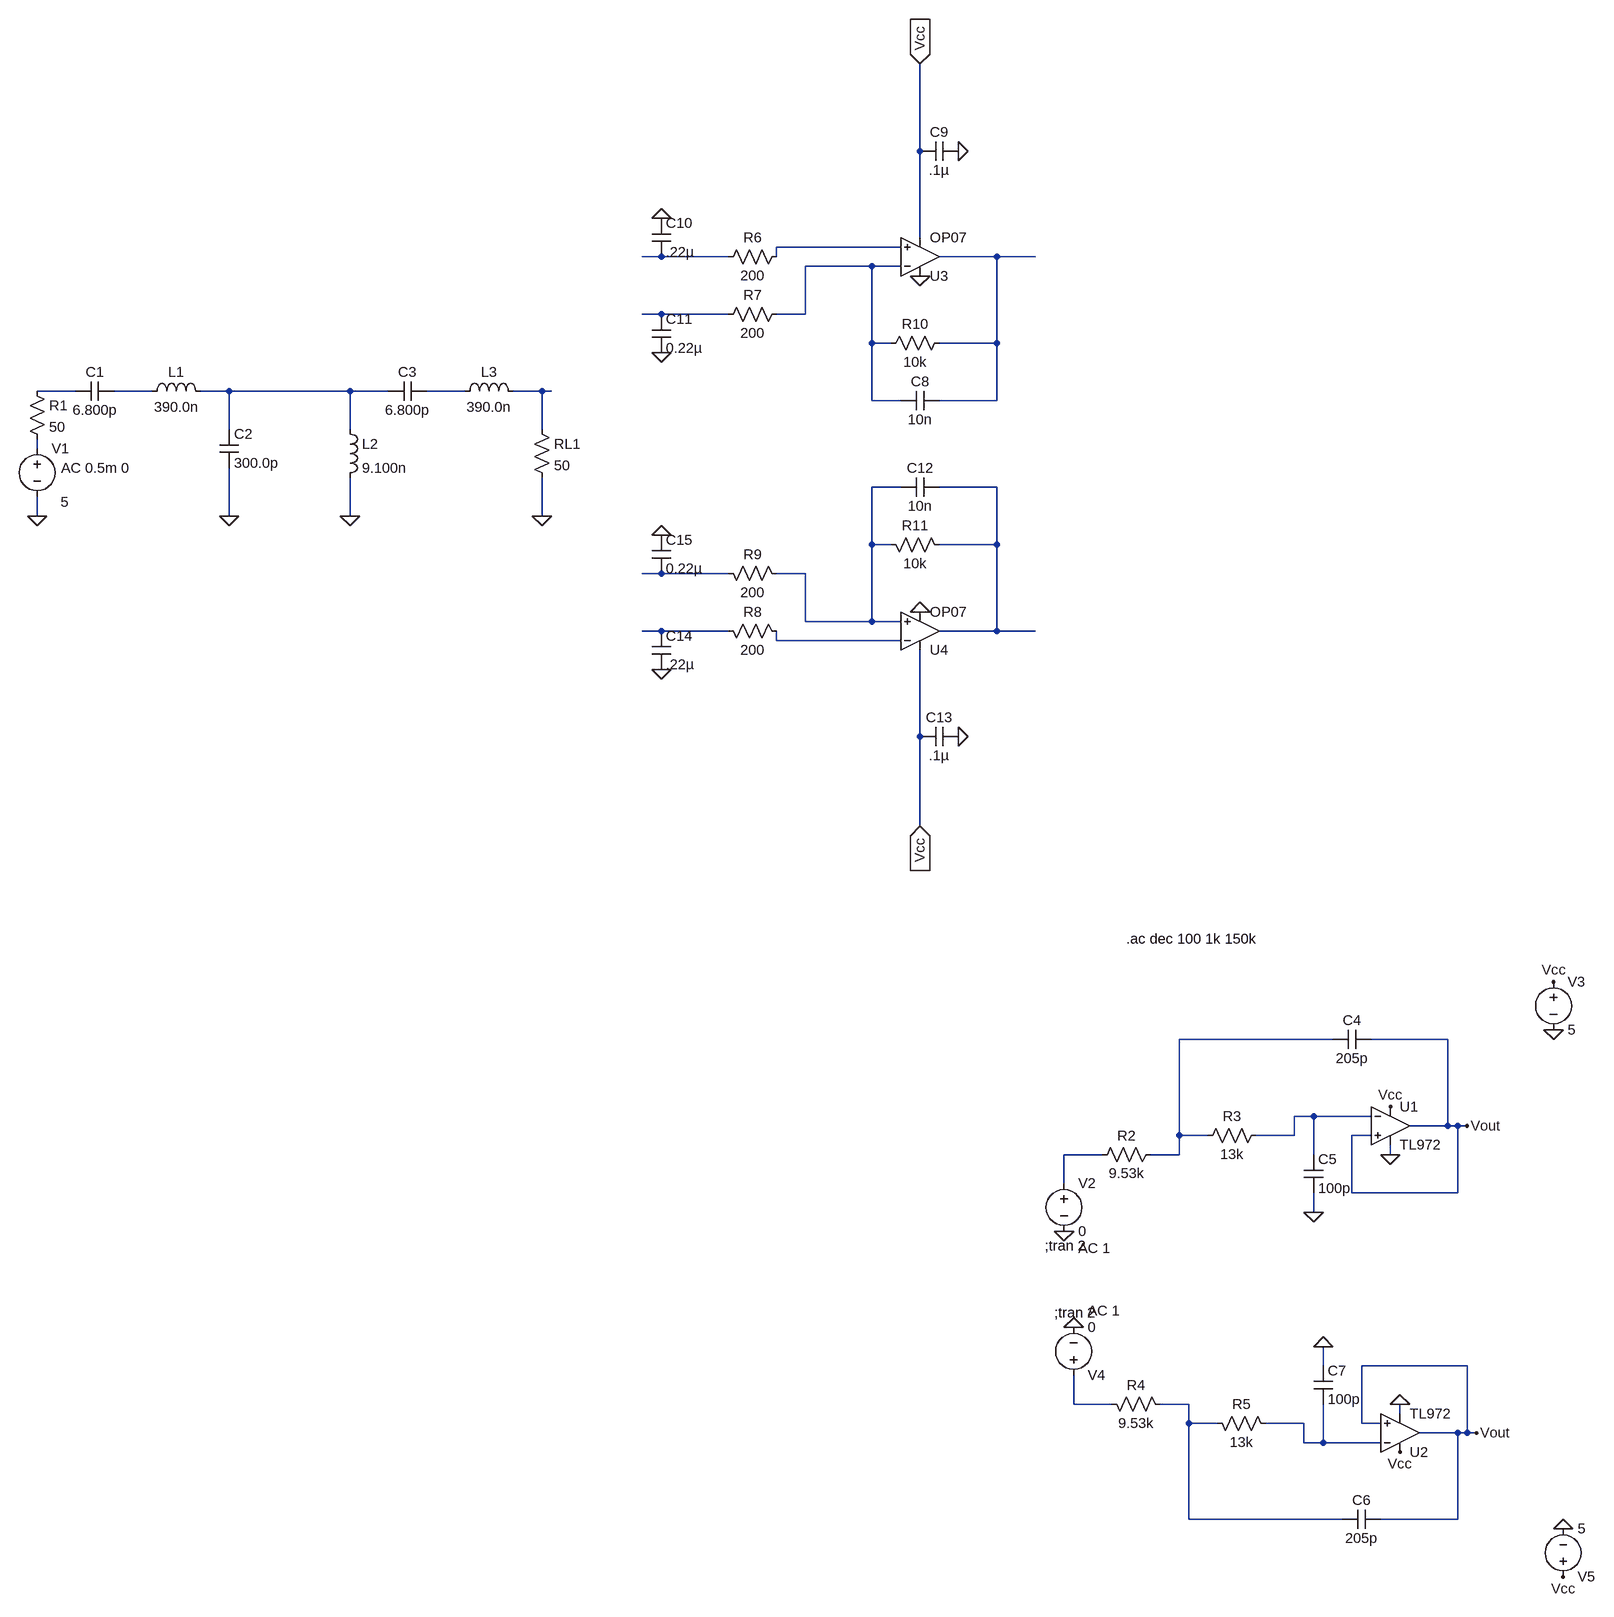
[diagram p0: schematic Full Simulation v1.asc]
Full Simulation v1.asc, the LTspice schematic file:
Version 4
SHEET 1 2552 2676
WIRE 1424 -240 1424 -416
WIRE 1424 -96 1424 -240
WIRE 1392 -80 1168 -80
WIRE 976 -64 944 -64
WIRE 1088 -64 976 -64
WIRE 1168 -64 1168 -80
WIRE 1552 -64 1456 -64
WIRE 1616 -64 1552 -64
WIRE 1344 -48 1216 -48
WIRE 1392 -48 1344 -48
WIRE 976 32 944 32
WIRE 1088 32 976 32
WIRE 1216 32 1216 -48
WIRE 1216 32 1168 32
WIRE 1344 80 1344 -48
WIRE 1376 80 1344 80
WIRE 1552 80 1552 -64
WIRE 1552 80 1456 80
WIRE -704 160 -768 160
WIRE -576 160 -640 160
WIRE -448 160 -496 160
WIRE -240 160 -448 160
WIRE -176 160 -240 160
WIRE -48 160 -112 160
WIRE 80 160 32 160
WIRE 96 160 80 160
WIRE 1344 176 1344 80
WIRE 1392 176 1344 176
WIRE 1552 176 1552 80
WIRE 1552 176 1456 176
WIRE -448 224 -448 160
WIRE -240 224 -240 160
WIRE 80 224 80 160
WIRE -768 256 -768 240
WIRE 1392 320 1344 320
WIRE 1552 320 1456 320
WIRE -768 368 -768 336
WIRE -448 368 -448 288
WIRE -240 368 -240 304
WIRE 80 368 80 304
WIRE 1344 416 1344 320
WIRE 1376 416 1344 416
WIRE 1552 416 1552 320
WIRE 1552 416 1456 416
WIRE 976 464 944 464
WIRE 1088 464 976 464
WIRE 1216 464 1168 464
WIRE 1216 544 1216 464
WIRE 1344 544 1344 416
WIRE 1344 544 1216 544
WIRE 1392 544 1344 544
WIRE 976 560 944 560
WIRE 1088 560 976 560
WIRE 1552 560 1552 416
WIRE 1552 560 1456 560
WIRE 1616 560 1552 560
WIRE 1168 576 1168 560
WIRE 1392 576 1168 576
WIRE 1424 736 1424 592
WIRE 1424 912 1424 736
WIRE 2112 1696 1856 1696
WIRE 2304 1696 2176 1696
WIRE 2080 1824 2048 1824
WIRE 2176 1824 2080 1824
WIRE 2304 1840 2304 1696
WIRE 2304 1840 2240 1840
WIRE 2320 1840 2304 1840
WIRE 2336 1840 2320 1840
WIRE 1856 1856 1856 1696
WIRE 1904 1856 1856 1856
WIRE 2048 1856 2048 1824
WIRE 2048 1856 1984 1856
WIRE 2176 1856 2144 1856
WIRE 1728 1888 1664 1888
WIRE 1856 1888 1856 1856
WIRE 1856 1888 1808 1888
WIRE 2080 1888 2080 1824
WIRE 2208 1888 2208 1872
WIRE 1664 1936 1664 1888
WIRE 2144 1952 2144 1856
WIRE 2320 1952 2320 1840
WIRE 2320 1952 2144 1952
WIRE 2080 1984 2080 1952
WIRE 2096 2240 2096 2208
WIRE 2336 2240 2160 2240
WIRE 1680 2304 1680 2256
WIRE 1744 2304 1680 2304
WIRE 1872 2304 1824 2304
WIRE 2224 2320 2224 2304
WIRE 1872 2336 1872 2304
WIRE 1920 2336 1872 2336
WIRE 2064 2336 2000 2336
WIRE 2160 2336 2160 2240
WIRE 2192 2336 2160 2336
WIRE 2320 2352 2256 2352
WIRE 2336 2352 2336 2240
WIRE 2336 2352 2320 2352
WIRE 2352 2352 2336 2352
WIRE 2064 2368 2064 2336
WIRE 2096 2368 2096 2304
WIRE 2096 2368 2064 2368
WIRE 2192 2368 2096 2368
WIRE 1872 2496 1872 2336
WIRE 2128 2496 1872 2496
WIRE 2320 2496 2320 2352
WIRE 2320 2496 2192 2496
FLAG -768 368 0
FLAG -448 368 0
FLAG -240 368 0
FLAG 80 368 0
FLAG 1664 2016 0
FLAG 2080 1984 0
FLAG 2336 1840 Vout
FLAG 2208 1808 Vcc
FLAG 2208 1888 0
FLAG 2480 1600 Vcc
FLAG 2480 1680 0
FLAG 1680 2176 0
FLAG 2096 2208 0
FLAG 2352 2352 Vout
FLAG 2224 2384 Vcc
FLAG 2224 2304 0
FLAG 2496 2592 Vcc
FLAG 2496 2512 0
FLAG 1488 -240 0
FLAG 1424 -32 0
FLAG 1424 -416 Vcc
IOPIN 1424 -416 In
FLAG 976 -128 0
FLAG 976 96 0
FLAG 1488 736 0
FLAG 1424 528 0
FLAG 1424 912 Vcc
IOPIN 1424 912 In
FLAG 976 624 0
FLAG 976 400 0
SYMBOL voltage -768 240 R0
WINDOW 123 40 48 Left 2
WINDOW 39 39 77 Left 2
WINDOW 3 39 105 Left 2
SYMATTR Value2 AC 0.5m 0
SYMATTR Value 5
SYMATTR InstName V1
SYMBOL cap -704 176 R270
WINDOW 0 32 32 VTop 2
WINDOW 3 0 32 VBottom 2
SYMATTR InstName C1
SYMATTR Value 6.800p
SYMBOL ind -592 176 R270
WINDOW 0 32 56 VTop 2
WINDOW 3 5 56 VBottom 2
SYMATTR InstName L1
SYMATTR Value 390.0n
SYMBOL cap -464 224 R0
SYMATTR InstName C2
SYMATTR Value 300.0p
SYMBOL ind -256 208 R0
SYMATTR InstName L2
SYMATTR Value 9.100n
SYMBOL cap -176 176 R270
WINDOW 0 32 32 VTop 2
WINDOW 3 0 32 VBottom 2
SYMATTR InstName C3
SYMATTR Value 6.800p
SYMBOL ind -64 176 R270
WINDOW 0 32 56 VTop 2
WINDOW 3 5 56 VBottom 2
SYMATTR InstName L3
SYMATTR Value 390.0n
SYMBOL res 64 208 R0
SYMATTR InstName RL1
SYMATTR Value 50
SYMBOL res -784 144 R0
SYMATTR InstName R1
SYMATTR Value 50
SYMBOL voltage 1664 1920 R0
WINDOW 123 24 124 Left 2
WINDOW 39 0 0 Left 0
SYMATTR Value2 AC 1
SYMATTR InstName V2
SYMATTR Value 0
SYMBOL res 1824 1872 R90
WINDOW 0 0 56 VBottom 2
WINDOW 3 32 56 VTop 2
SYMATTR InstName R2
SYMATTR Value 9.53k
SYMBOL res 2000 1840 R90
WINDOW 0 0 56 VBottom 2
WINDOW 3 32 56 VTop 2
SYMATTR InstName R3
SYMATTR Value 13k
SYMBOL cap 2176 1680 R90
WINDOW 0 0 32 VBottom 2
WINDOW 3 32 32 VTop 2
SYMATTR InstName C4
SYMATTR Value 205p
SYMBOL cap 2064 1888 R0
SYMATTR InstName C5
SYMATTR Value 100p
SYMBOL OpAmps\\opamp2 2208 1776 R0
SYMATTR InstName U1
SYMATTR Value TL972
SYMBOL voltage 2480 1584 R0
WINDOW 123 0 0 Left 0
WINDOW 39 0 0 Left 0
SYMATTR InstName V3
SYMATTR Value 5
SYMBOL voltage 1680 2272 M180
WINDOW 123 24 124 Left 2
WINDOW 39 0 0 Left 0
SYMATTR Value2 AC 1
SYMATTR InstName V4
SYMATTR Value 0
SYMBOL res 1840 2320 M270
WINDOW 0 32 56 VTop 2
WINDOW 3 0 56 VBottom 2
SYMATTR InstName R4
SYMATTR Value 9.53k
SYMBOL res 2016 2352 M270
WINDOW 0 32 56 VTop 2
WINDOW 3 0 56 VBottom 2
SYMATTR InstName R5
SYMATTR Value 13k
SYMBOL cap 2192 2512 M270
WINDOW 0 32 32 VTop 2
WINDOW 3 0 32 VBottom 2
SYMATTR InstName C6
SYMATTR Value 205p
SYMBOL cap 2080 2304 M180
WINDOW 0 24 56 Left 2
WINDOW 3 24 8 Left 2
SYMATTR InstName C7
SYMATTR Value 100p
SYMBOL OpAmps\\opamp2 2224 2416 M180
SYMATTR InstName U2
SYMATTR Value TL972
SYMBOL voltage 2496 2608 M180
WINDOW 123 0 0 Left 0
WINDOW 39 0 0 Left 0
SYMATTR InstName V5
SYMATTR Value 5
SYMBOL OpAmps\\OP07 1424 0 M180
SYMATTR InstName U3
SYMBOL res 1184 -80 R90
WINDOW 0 0 56 VBottom 2
WINDOW 3 32 56 VTop 2
SYMATTR InstName R6
SYMATTR Value 200
SYMBOL res 1184 16 R90
WINDOW 0 0 56 VBottom 2
WINDOW 3 32 56 VTop 2
SYMATTR InstName R7
SYMATTR Value 200
SYMBOL res 1472 64 R90
WINDOW 0 0 56 VBottom 2
WINDOW 3 32 56 VTop 2
SYMATTR InstName R10
SYMATTR Value 10k
SYMBOL cap 1456 160 R90
WINDOW 0 0 32 VBottom 2
WINDOW 3 32 32 VTop 2
SYMATTR InstName C8
SYMATTR Value 10n
SYMBOL cap 1488 -256 R90
WINDOW 0 0 32 VBottom 2
WINDOW 3 32 32 VTop 2
SYMATTR InstName C9
SYMATTR Value .1µ
SYMBOL cap 960 -128 R0
SYMATTR InstName C10
SYMATTR Value .22µ
SYMBOL cap 960 32 R0
SYMATTR InstName C11
SYMATTR Value 0.22µ
SYMBOL OpAmps\\OP07 1424 624 M180
SYMATTR InstName U4
SYMBOL res 1184 576 M270
WINDOW 0 32 56 VTop 2
WINDOW 3 0 56 VBottom 2
SYMATTR InstName R8
SYMATTR Value 200
SYMBOL res 1184 480 M270
WINDOW 0 32 56 VTop 2
WINDOW 3 0 56 VBottom 2
SYMATTR InstName R9
SYMATTR Value 200
SYMBOL res 1472 432 M270
WINDOW 0 32 56 VTop 2
WINDOW 3 0 56 VBottom 2
SYMATTR InstName R11
SYMATTR Value 10k
SYMBOL cap 1456 336 M270
WINDOW 0 32 32 VTop 2
WINDOW 3 0 32 VBottom 2
SYMATTR InstName C12
SYMATTR Value 10n
SYMBOL cap 1488 752 M270
WINDOW 0 32 32 VTop 2
WINDOW 3 0 32 VBottom 2
SYMATTR InstName C13
SYMATTR Value .1µ
SYMBOL cap 960 624 M180
WINDOW 0 24 56 Left 2
WINDOW 3 24 8 Left 2
SYMATTR InstName C14
SYMATTR Value .22µ
SYMBOL cap 960 464 M180
WINDOW 0 24 56 Left 2
WINDOW 3 24 8 Left 2
SYMATTR InstName C15
SYMATTR Value 0.22µ
TEXT 1632 2040 Left 2 !;tran 2
TEXT 1768 1528 Left 2 !.ac dec 100 1k 150k
TEXT 1648 2152 Left 2 !;tran 2

The netlist it stands for:
* Full Simulation v1.asc
V1 N011 0 5 AC 0.5m 0
C1 N006 N007 6.800p
L1 N007 N008 390.0n
C2 N008 0 300.0p
L2 N008 0 9.100n
C3 N008 N009 6.800p
L3 N009 N010 390.0n
RL1 N010 0 50
R1 N006 N011 50
V2 N019 0 0 AC 1
R2 N017 N019 9.53k
R3 N018 N017 13k
C4 Vout N017 205p
C5 N018 0 100p
XU1 Vout N018 Vcc 0 Vout TL972  ; pins In+ In- V+ V- OUT
V3 Vcc 0 5
V4 N020 0 0 AC 1
R4 N021 N020 9.53k
R5 N022 N021 13k
C6 Vout N021 205p
C7 N022 0 100p
XU2 Vout N022 Vcc 0 Vout TL972  ; pins In+ In- V+ V- OUT
V5 Vcc 0 5
XU3 N001 N004 0 Vcc N003 LT1001  ; OP07, pins In+ In- V+ V- OUT
R6 N001 N002 200
R7 N004 N005 200
R10 N003 N004 10k
C8 N003 N004 10n
C9 0 Vcc .1µ
C10 0 N002 .22µ
C11 N005 0 0.22µ
XU4 N012 N016 Vcc 0 N013 LT1001  ; OP07, pins In+ In- V+ V- OUT
R8 N016 N015 200
R9 N012 N014 200
R11 N013 N012 10k
C12 N013 N012 10n
C13 0 Vcc .1µ
C14 0 N015 .22µ
C15 N014 0 0.22µ
;tran 2
.ac dec 100 1k 150k
;tran 2
.lib LTC.lib
.backanno
.end